# Altium project belt_control_V2.0.PrjPCB
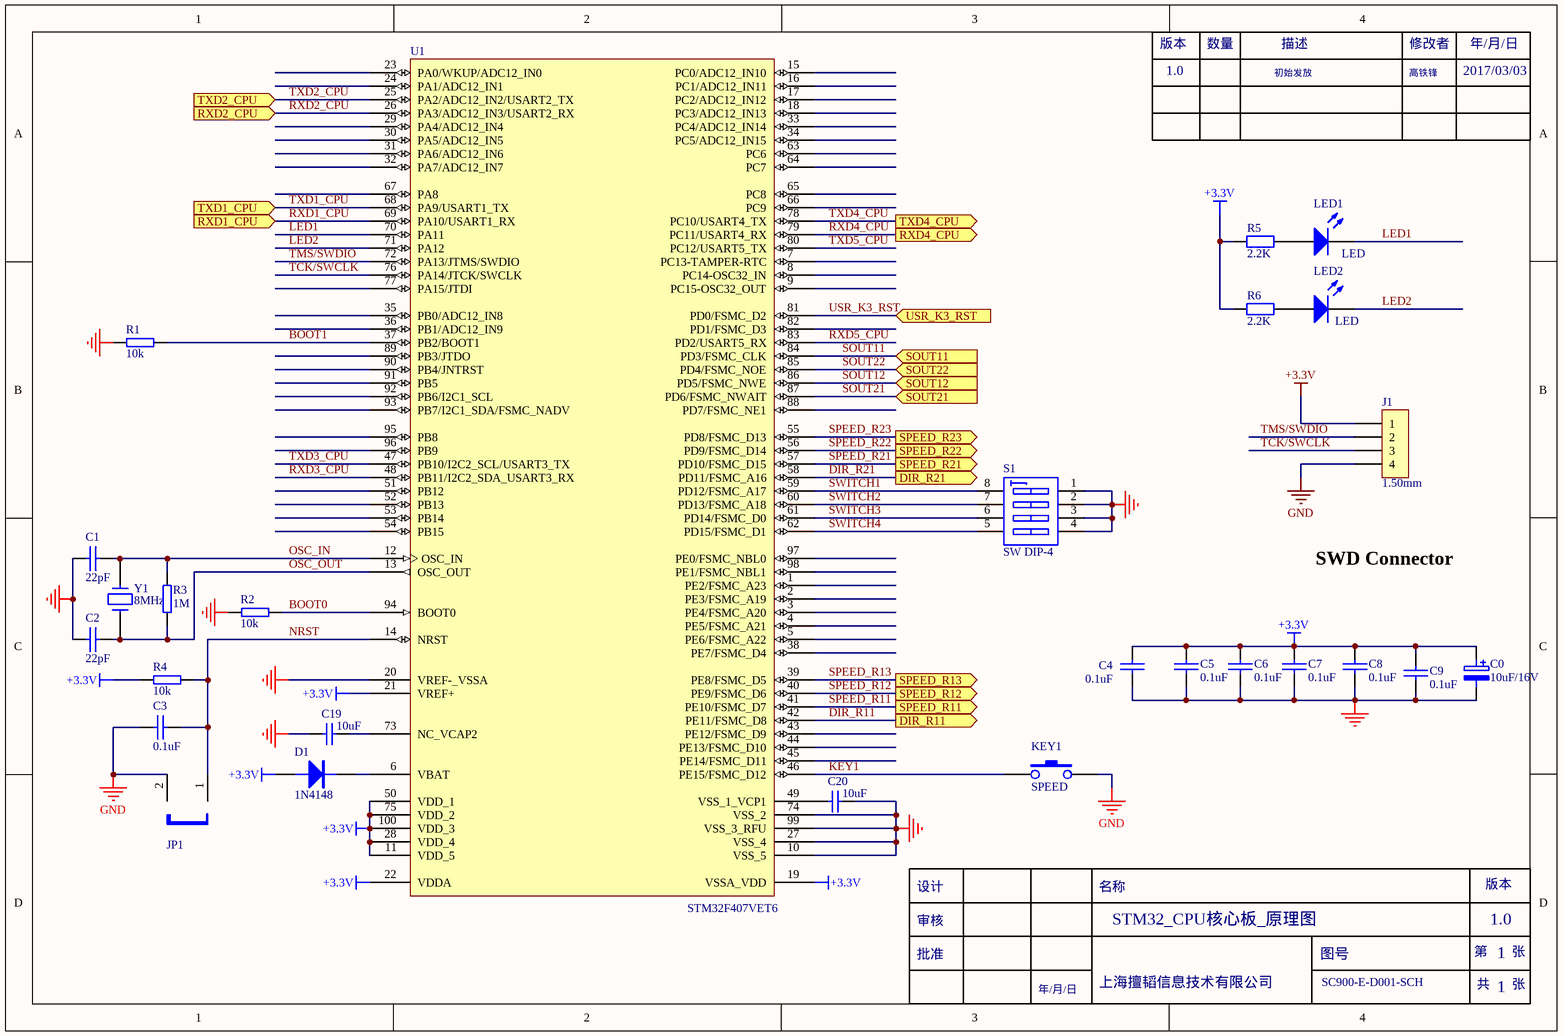
[diagram p0: cpu.SchDoc]
5 sheets, 118 parts. Net scope: flat (ports and power ports of the same name join across sheets).
Board file: belt_control_V2.0.PcbDoc
Sheets:
  cpu.SchDoc
  power.SchDoc
  belt_output.SchDoc
  senror_input.SchDoc
  communication.SchDoc

## Sheet cpu.SchDoc
size A4; Author: 上海擅韬信息技术有限公司

### Parts
C0  10uF/16V  [CASE-A_3216]
C1  22pF  [0805_CAP]
C2  22pF  [0805_CAP]
C3  0.1uF  [0805_CAP]
C4  0.1uF  [0805_CAP]
C5  0.1uF  [0805_CAP]
C6  0.1uF  [0805_CAP]
C7  0.1uF  [0805_CAP]
C8  0.1uF  [0805_CAP]
C9  0.1uF  [0805_CAP]
C19  10uF  [0805_CAP]
C20  10uF  [0805_CAP]
D1  1N4148  [LL-34(玻璃二极管)]
J1  1.50mm  [PH1.5_4P]
JP1  JUMPER  [SIP2]  (value not drawn)
KEY1  SPEED  [SW_PB_SMD_6X6]
LED1  LED  [0805-LED-R]
LED2  LED  [0805-LED-R]
R1  10k  [0805_RES]
R2  10k  [0805_RES]
R3  1M  [0805_RES]
R4  10k  [0805_RES]
R5  2.2K  [0805_RES]
R6  2.2K  [0805_RES]
S1  SW DIP-4  [SOP8_switch]
U1  STM32F407VET6  [LQFP100_14x14]
Y1  8MHz  [XTAL_US1]

### Ports
DIR_R11 (out), DIR_R21 (out), RXD1_CPU (in), RXD2_CPU (in), RXD4_CPU (out), SOUT11 (in), SOUT12 (in), SOUT21 (in), SOUT22 (in), SPEED_R11 (out), SPEED_R12 (out), SPEED_R13 (out), SPEED_R21 (out), SPEED_R22 (out), SPEED_R23 (out), TXD1_CPU (in), TXD2_CPU (in), TXD4_CPU (out), USR_K3_RST (in)

### Nets
+3.3V: C0.1 C4.1 C5.1 C6.1 C7.1 C8.1 C9.1 D1.1(A) J1.1 R4.1 R5.2 R6.2 U1.11(VDD_5) U1.19(VSSA_VDD) U1.21(VREF+) U1.22(VDDA) U1.28(VDD_4) U1.50(VDD_1) U1.75(VDD_2) U1.100(VDD_3)
GND: C0.2 C1.1 C2.1 C3.1 C4.2 C5.2 C6.2 C7.2 C8.2 C9.2 C19.2 C20.1 J1.4 JP1.2 KEY1.2 R1.1 R2.1 S1.1(A1) S1.2(A2) S1.3(A3) S1.4(A4) U1.10(VSS_5) U1.20(VREF-_VSSA) U1.27(VSS_4) U1.74(VSS_2) U1.99(VSS_3_RFU)
BOOT0: R2.2 U1.94(BOOT0)
BOOT1: R1.2 U1.37(PB2/BOOT1)
DIR_R11: U1.42(PE11/FSMC_D8) ; port DIR_R11
DIR_R21: U1.58(PD11/FSMC_A16) ; port DIR_R21
KEY1: KEY1.1 U1.46(PE15/FSMC_D12)
LED1: LED1.2(K) U1.70(PA11)
LED2: LED2.2(K) U1.71(PA12)
NRST: C3.2 JP1.1 R4.2 U1.14(NRST)
OSC_IN: C1.2 R3.2 U1.12(OSC_IN) Y1.2
OSC_OUT: C2.2 R3.1 U1.13(OSC_OUT) Y1.1
RXD1_CPU: U1.69(PA10/USART1_RX) ; port RXD1_CPU
RXD2_CPU: U1.26(PA3/ADC12_IN3/USART2_RX) ; port RXD2_CPU
RXD3_CPU: U1.48(PB11/I2C2_SDA_USART3_RX)
RXD4_CPU: U1.79(PC11/USART4_RX) ; port RXD4_CPU
RXD5_CPU: U1.83(PD2/USART5_RX)
SOUT11: U1.84(PD3/FSMC_CLK) ; port SOUT11
SOUT12: U1.86(PD5/FSMC_NWE) ; port SOUT12
SOUT21: U1.87(PD6/FSMC_NWAIT) ; port SOUT21
SOUT22: U1.85(PD4/FSMC_NOE) ; port SOUT22
SPEED_R11: U1.41(PE10/FSMC_D7) ; port SPEED_R11
SPEED_R12: U1.40(PE9/FSMC_D6) ; port SPEED_R12
SPEED_R13: U1.39(PE8/FSMC_D5) ; port SPEED_R13
SPEED_R21: U1.57(PD10/FSMC_D15) ; port SPEED_R21
SPEED_R22: U1.56(PD9/FSMC_D14) ; port SPEED_R22
SPEED_R23: U1.55(PD8/FSMC_D13) ; port SPEED_R23
SWITCH1: S1.8(B5) U1.59(PD12/FSMC_A17)
SWITCH2: S1.7(B6) U1.60(PD13/FSMC_A18)
SWITCH3: S1.6(A6) U1.61(PD14/FSMC_D0)
SWITCH4: S1.5(A5) U1.62(PD15/FSMC_D1)
TCK/SWCLK: J1.3 U1.76(PA14/JTCK/SWCLK)
TMS/SWDIO: J1.2 U1.72(PA13/JTMS/SWDIO)
TXD1_CPU: U1.68(PA9/USART1_TX) ; port TXD1_CPU
TXD2_CPU: U1.25(PA2/ADC12_IN2/USART2_TX) ; port TXD2_CPU
TXD3_CPU: U1.47(PB10/I2C2_SCL/USART3_TX)
TXD4_CPU: U1.78(PC10/USART4_TX) ; port TXD4_CPU
TXD5_CPU: U1.80(PC12/USART5_TX)
USR_K3_RST: U1.81(PD0/FSMC_D2) ; port USR_K3_RST
NetC19_1: C19.1 U1.73(NC_VCAP2)
NetC20_2: C20.2 U1.49(VSS_1_VCP1)
NetD1_2: D1.2(K) U1.6(VBAT)
NetLED1_1: LED1.1(A) R5.1
NetLED2_1: LED2.1(A) R6.1

Not connected (* = marked no-connect by the designer): U1 1(PE2/FSMC_A23) 2(PE3/FSMC_A19) 3(PE4/FSMC_A20) 4(PE5/FSMC_A21) 5(PE6/FSMC_A22) 7(PC13-TAMPER-RTC) 8(PC14-OSC32_IN) 9(PC15-OSC32_OUT) 15(PC0/ADC12_IN10) 16(PC1/ADC12_IN11) 17(PC2/ADC12_IN12) 18(PC3/ADC12_IN13) 23(PA0/WKUP/ADC12_IN0) 24(PA1/ADC12_IN1) 29(PA4/ADC12_IN4) 30(PA5/ADC12_IN5) 31(PA6/ADC12_IN6) 32(PA7/ADC12_IN7) 33(PC4/ADC12_IN14) 34(PC5/ADC12_IN15) 35(PB0/ADC12_IN8) 36(PB1/ADC12_IN9) 38(PE7/FSMC_D4) 43(PE12/FSMC_D9) 44(PE13/FSMC_D10) 45(PE14/FSMC_D11) 51(PB12) 52(PB13) 53(PB14) 54(PB15) 63(PC6) 64(PC7) 65(PC8) 66(PC9) 67(PA8) 77(PA15/JTDI) 82(PD1/FSMC_D3) 88(PD7/FSMC_NE1) 89(PB3/JTDO) 90(PB4/JNTRST) 91(PB5) 92(PB6/I2C1_SCL) 93(PB7/I2C1_SDA/FSMC_NADV) 95(PB8) 96(PB9) 97(PE0/FSMC_NBL0) 98(PE1/FSMC_NBL1)

### Notes on the sheet
- 1.0
- 初始发放
- 高铁锋
- 2017/03/03
- SWD Connector
- STM32_CPU核心板_原理图
- SC900-E-D001-SCH
- 1
- 版本
- 数量
- 描述
- 修改者
- 年/月/日
- 设计
- 审核
- 名称
- 批准
- 图号
- 第
- 共
- 张

### Library data of the parts
C0 = ELECTRO2: Electrolytic Capacitor
C1-C9 = CAP: Capacitor
C19 C20 = 0805 100nF(104) 10% 50V: 贴片电容; ComponentLink1Description: 供应商链接; ComponentLink1URL: http://www.szlcsc.com/product/details_50686.html; Package: 0805; Supplier: LC; SuppliersPartNumber: C49678
D1 = DIODE: LL-34(玻璃二极管)
J1 = CON4: Connector
JP1 = JUMPER: 2.54间距，2P，单排插针
KEY1 = SW-KEY-2
LED1 LED2 = LED2: Typical RED, GREEN, YELLOW, AMBER GaAs LED; Published: 8-Jun-2000; LatestRevisionDate: 17-Jul-2002; LatestRevisionNote: Re-released for DXP Platform.; PackageDocument: Feb-2002; PackageReference: 3.2X1.6X1.1; Publisher: Altium Limited
R1-R4 = RES
R5 R6 = Res2: Resistor; Published: 8-Jun-2000; LatestRevisionDate: 17-Jul-2002; LatestRevisionNote: Re-released for DXP Platform.; PackageReference: AXIAL-0.4; Publisher: Altium Limited; Value: 2.2K
S1 = SW DIP-4: DIP Switch
U1 = STM32F2xx_100: STM32 ARM-based 32-bit MCU with 64 Kbytes Flash, 100-pin LQFP, Industrial Temperature
Y1 = CRYSTAL

## Sheet power.SchDoc
size A3
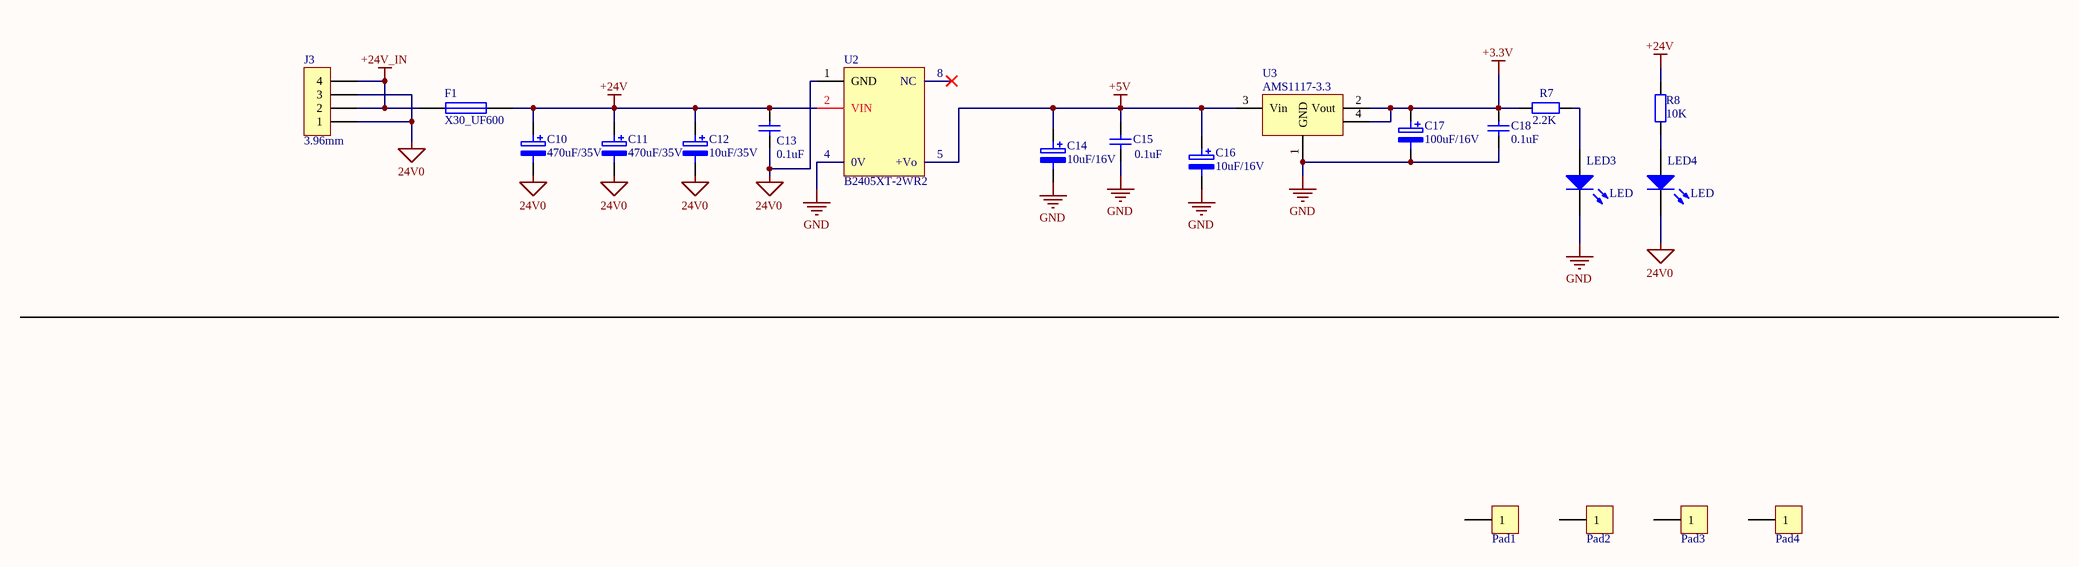
[diagram p1: power.SchDoc]

### Parts
C10  470uF/35V  [CE/10MM]
C11  470uF/35V  [CE/10MM]
C12  10uF/35V  [TC6032_C]
C13  0.1uF  [0805_CAP]
C14  10uF/16V  [CASE-A_3216]
C15  0.1uF  [0805_CAP]
C16  10uF/16V  [CASE-A_3216]
C17  100uF/16V  [TC6032_C]
C18  0.1uF  [0805_CAP]
F1  X30_UF600  [X30UF600]
J3  3.96mm  [VH3.96_4P]
LED3  LED  [0805-LED-G]
LED4  LED  [0805-LED-G]
Pad1  Pad  [pad35]  (value not drawn)
Pad2  Pad  [pad35]  (value not drawn)
Pad3  Pad  [pad35]  (value not drawn)
Pad4  Pad  [pad35]  (value not drawn)
R7  2.2K  [0805_RES]
R8  10K  [0805_RES]
U2  B2405XT-2WR2  [B2405XT-2WR2]
U3  AMS1117-3.3  [SOT223_3]

### Nets
24V0: C10.2 C11.2 C12.2 C13.1 J3.1 J3.3 LED4.2(K) U2.1(GND)
+3.3V: C17.1 C18.2 R7.2 U3.2(Vout) U3.4
+5V: C14.1 C15.2 C16.1 U2.5(+Vo) U3.3(Vin)
+24V: C10.1 C11.1 C12.1 C13.2 F1.2 R8.2 U2.2(VIN)
+24V_IN: F1.1 J3.2 J3.4
GND: C14.2 C15.1 C16.2 C17.2 C18.1 LED3.2(K) U2.4(0V) U3.1(GND)
NetLED3_1: LED3.1(A) R7.1
NetLED4_1: LED4.1(A) R8.1

Not connected (* = marked no-connect by the designer): Pad1 1; Pad2 1; Pad3 1; Pad4 1; U2 8(NC)*

### Notes on the sheet
- 电源电路

### Library data of the parts
C10-C12 C14 C16 C17 = ELECTRO2: Electrolytic Capacitor
C13 C15 C18 = Cap: Capacitor; Published: 8-Jun-2000; LatestRevisionDate: 17-Jul-2002; LatestRevisionNote: Re-released for DXP Platform.; PackageReference: RAD-0.3; Publisher: Altium Limited
  C13 C18: Value: 0.1uF
F1 = Fuse 1: Fuse; Published: 8-Jun-2000; LatestRevisionDate: 17-Jul-2002; LatestRevisionNote: Re-released for DXP Platform.; PackageReference: PIN-W2/E2.8; Publisher: Altium Limited
J3 = CON4: Connector
LED3 LED4 = LED2: as LED1 on sheet cpu; Published: 8-Jun-2000; LatestRevisionDate: 17-Jul-2002; LatestRevisionNote: Re-released for DXP Platform.; PackageDocument: Feb-2002; PackageReference: 3.2X1.6X1.1; Publisher: Altium Limited
R7 R8 = Res2: Resistor; Published: 8-Jun-2000; LatestRevisionDate: 17-Jul-2002; LatestRevisionNote: Re-released for DXP Platform.; PackageReference: AXIAL-0.4; Publisher: Altium Limited
  R7: Value: 2.2K
  R8: Value: 10K
U3 = AMS1117-5

## Sheet belt_output.SchDoc
size A3
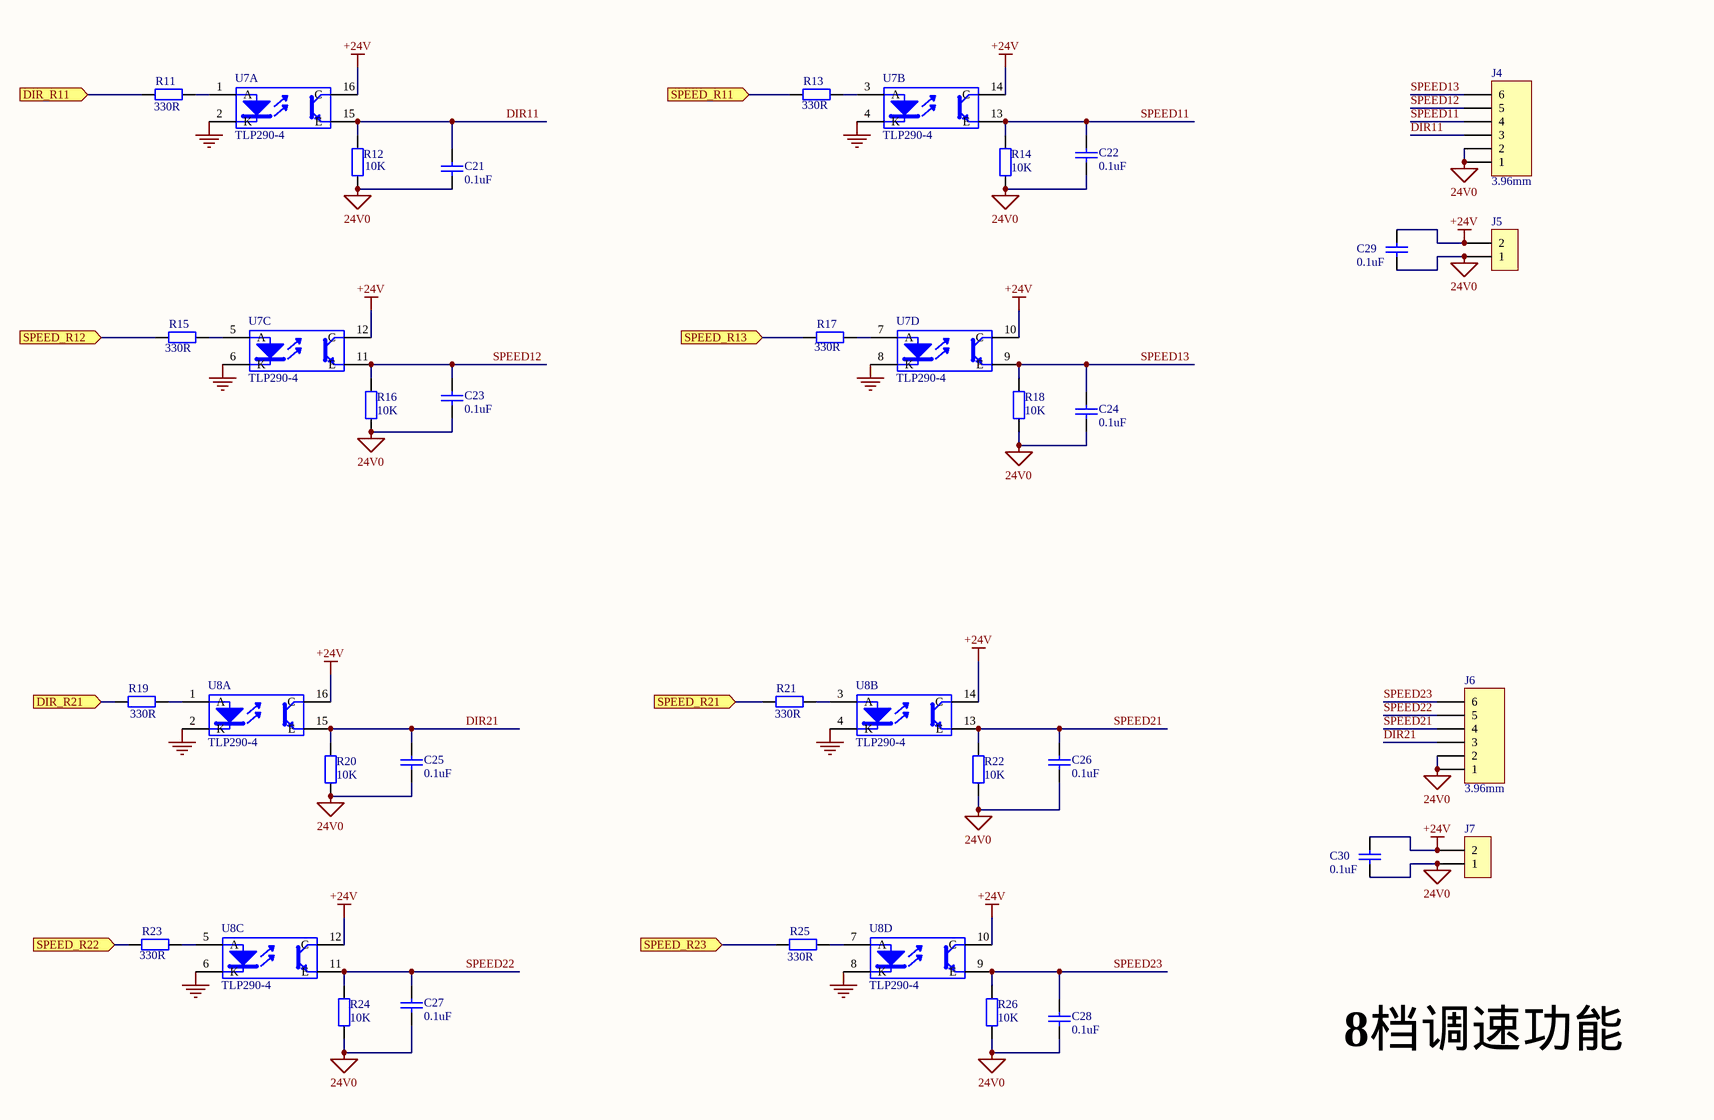
[diagram p2: belt_output.SchDoc]

### Parts
C21  0.1uF  [0805_CAP]
C22  0.1uF  [0805_CAP]
C23  0.1uF  [0805_CAP]
C24  0.1uF  [0805_CAP]
C25  0.1uF  [0805_CAP]
C26  0.1uF  [0805_CAP]
C27  0.1uF  [0805_CAP]
C28  0.1uF  [0805_CAP]
C29  0.1uF  [0805_CAP]
C30  0.1uF  [0805_CAP]
J4  3.96mm  [VH3.96_6P]
J5  HEADER1X2  [VH3.96_2P]  (value not drawn)
J6  3.96mm  [VH3.96_6P]
J7  HEADER1X2  [VH3.96_2P]  (value not drawn)
R11  330R  [0805_RES]
R12  10K  [0805_RES]
R13  330R  [0805_RES]
R14  10K  [0805_RES]
R15  330R  [0805_RES]
R16  10K  [0805_RES]
R17  330R  [0805_RES]
R18  10K  [0805_RES]
R19  330R  [0805_RES]
R20  10K  [0805_RES]
R21  330R  [0805_RES]
R22  10K  [0805_RES]
R23  330R  [0805_RES]
R24  10K  [0805_RES]
R25  330R  [0805_RES]
R26  10K  [0805_RES]
U7  TLP290-4  [SO16]  (parts A,B,C,D of 4)
U8  TLP290-4  [SO16]  (parts A,B,C,D of 4)

### Ports
DIR_R11 (in), DIR_R21 (in), SPEED_R11 (in), SPEED_R12 (in), SPEED_R13 (in), SPEED_R21 (in), SPEED_R22 (in), SPEED_R23 (in)

### Nets
24V0: C21.2 C22.2 C23.2 C24.2 C25.2 C26.2 C27.2 C28.2 C29.2 C30.2 J4.1 J4.2 J5.1 J6.1 J6.2 J7.1 R12.1 R14.1 R16.1 R18.1 R20.1 R22.1 R24.1 R26.1
+24V: C29.1 C30.1 J5.2 J7.2 U7.10(C) U7.12(C) U7.14(C) U7.16(C) U8.10(C) U8.12(C) U8.14(C) U8.16(C)
GND: U7.2(K) U7.4(K) U7.6(K) U7.8(K) U8.2(K) U8.4(K) U8.6(K) U8.8(K)
DIR11: C21.1 J4.3 R12.2 U7.15(E)
DIR21: C25.1 J6.3 R20.2 U8.15(E)
DIR_R11: R11.1 ; port DIR_R11
DIR_R21: R19.1 ; port DIR_R21
SPEED11: C22.1 J4.4 R14.2 U7.13(E)
SPEED12: C23.1 J4.5 R16.2 U7.11(E)
SPEED13: C24.1 J4.6 R18.2 U7.9(E)
SPEED21: C26.1 J6.4 R22.2 U8.13(E)
SPEED22: C27.1 J6.5 R24.2 U8.11(E)
SPEED23: C28.1 J6.6 R26.2 U8.9(E)
SPEED_R11: R13.1 ; port SPEED_R11
SPEED_R12: R15.1 ; port SPEED_R12
SPEED_R13: R17.1 ; port SPEED_R13
SPEED_R21: R21.1 ; port SPEED_R21
SPEED_R22: R23.1 ; port SPEED_R22
SPEED_R23: R25.1 ; port SPEED_R23
NetR11_2: R11.2 U7.1(A)
NetR13_2: R13.2 U7.3(A)
NetR15_2: R15.2 U7.5(A)
NetR17_2: R17.2 U7.7(A)
NetR19_2: R19.2 U8.1(A)
NetR21_2: R21.2 U8.3(A)
NetR23_2: R23.2 U8.5(A)
NetR25_2: R25.2 U8.7(A)

### Notes on the sheet
- 8档调速功能

### Library data of the parts
C21-C30 = Cap: Capacitor; Published: 8-Jun-2000; LatestRevisionDate: 17-Jul-2002; LatestRevisionNote: Re-released for DXP Platform.; PackageReference: RAD-0.3; Publisher: Altium Limited; Value: 0.1uF
J4 = Header 6H: Header, 6-Pin, Right Angle; LatestRevisionDate: 17-Jul-2002; LatestRevisionNote: Re-released for DXP Platform.; Publisher: Altium Limited
J6 = Header 6: Header, 6-Pin; LatestRevisionDate: 17-Jul-2002; LatestRevisionNote: Re-released for DXP Platform.; Publisher: Altium Limited
R11 R13 R15 R17 R19 R21 R23 R25 = Res2: Resistor; Value: 220; Published: 8-Jun-2000; LatestRevisionDate: 17-Jul-2002; LatestRevisionNote: Re-released for DXP Platform.; PackageReference: AXIAL-0.4; Publisher: Altium Limited
R12 R14 R16 R18 R20 R22 R24 R26 = Res2: Resistor; Published: 8-Jun-2000; LatestRevisionDate: 17-Jul-2002; LatestRevisionNote: Re-released for DXP Platform.; PackageReference: AXIAL-0.4; Publisher: Altium Limited; Value: 10K
U7 U8 = TLP521-4

## Sheet senror_input.SchDoc
size A3
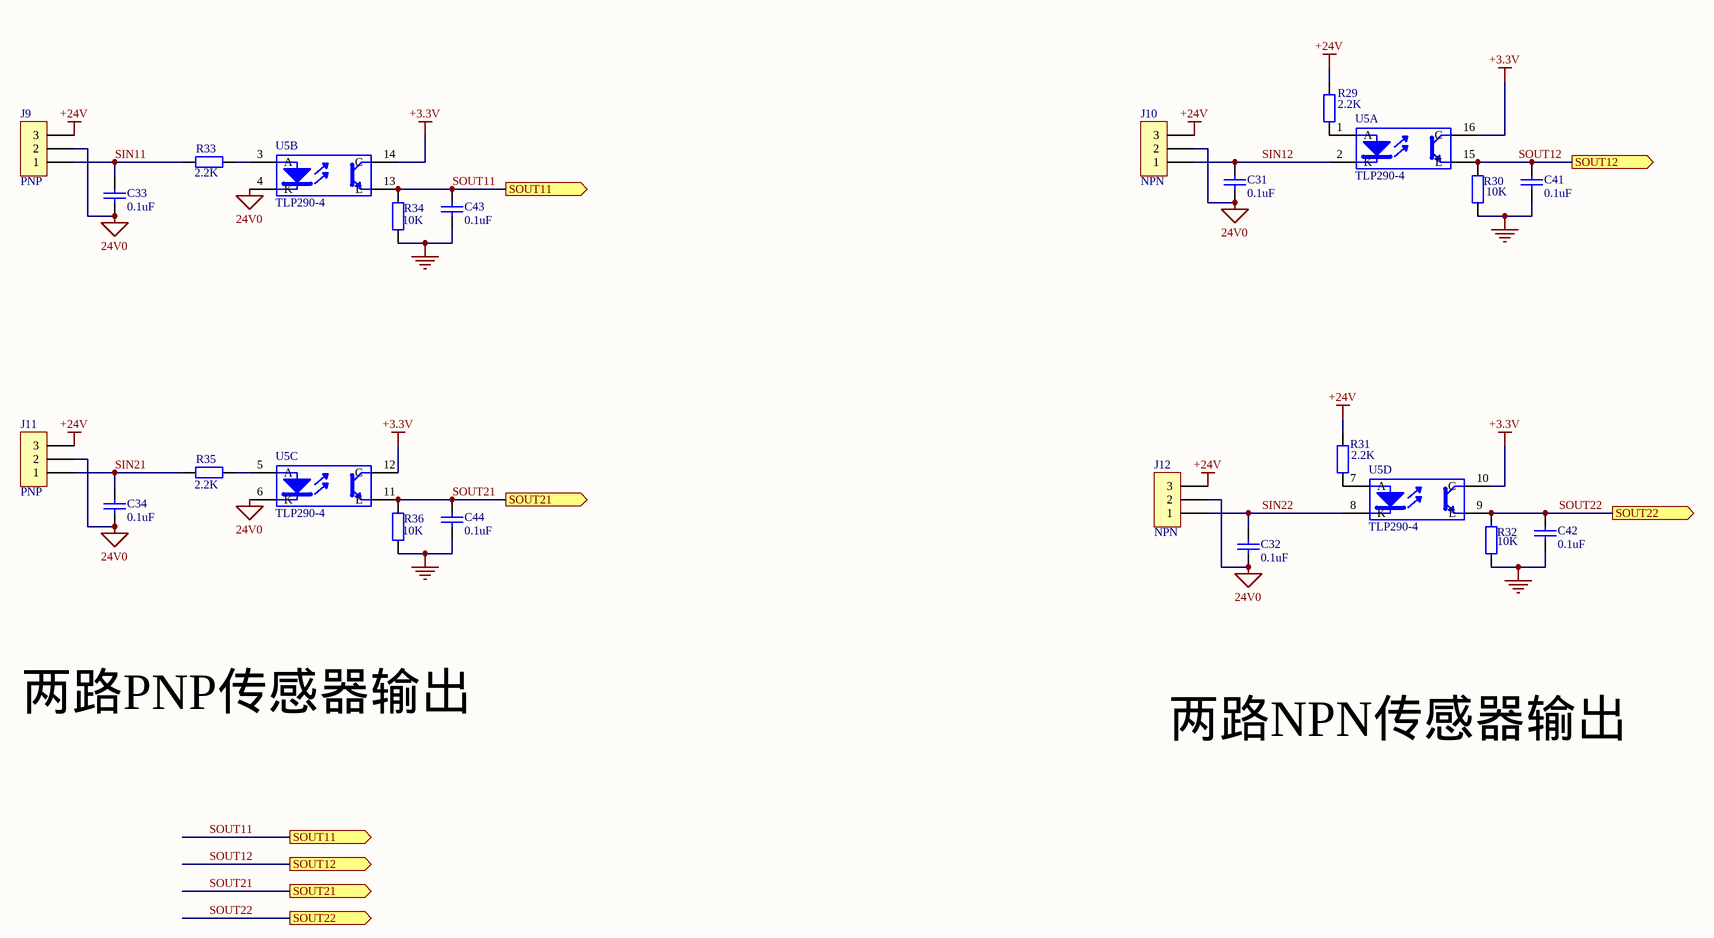
[diagram p3: senror_input.SchDoc]

### Parts
C31  0.1uF  [0805_CAP]
C32  0.1uF  [0805_CAP]
C33  0.1uF  [0805_CAP]
C34  0.1uF  [0805_CAP]
C41  0.1uF  [0805_CAP]
C42  0.1uF  [0805_CAP]
C43  0.1uF  [0805_CAP]
C44  0.1uF  [0805_CAP]
J9  HEADER1X3  [VH3.96_3P]  (value not drawn)
J10  HEADER1X3  [VH3.96_3P]  (value not drawn)
J11  HEADER1X3  [VH3.96_3P]  (value not drawn)
J12  HEADER1X3  [VH3.96_3P]  (value not drawn)
R29  2.2K  [0805_RES]
R30  10K  [0805_RES]
R31  2.2K  [0805_RES]
R32  10K  [0805_RES]
R33  2.2K  [0805_RES]
R34  10K  [0805_RES]
R35  2.2K  [0805_RES]
R36  10K  [0805_RES]
U5  TLP290-4  [SO16]  (parts A,B,C,D of 4)

### Ports
SOUT11 (out), SOUT12 (out), SOUT21 (out), SOUT22 (out)

### Nets
24V0: C31.2 C32.2 C33.2 C34.2 J9.2 J10.2 J11.2 J12.2 U5.4(K) U5.6(K)
+3.3V: U5.10(C) U5.12(C) U5.14(C) U5.16(C)
+24V: J9.3 J10.3 J11.3 J12.3 R29.1 R31.1
GND: C41.2 C42.2 C43.2 C44.2 R30.2 R32.2 R34.2 R36.2
SIN11: C33.1 J9.1 R33.1
SIN12: C31.1 J10.1 U5.2(K)
SIN21: C34.1 J11.1 R35.1
SIN22: C32.1 J12.1 U5.8(K)
SOUT11: C43.1 R34.1 U5.13(E) ; port SOUT11
SOUT12: C41.1 R30.1 U5.15(E) ; port SOUT12
SOUT21: C44.1 R36.1 U5.11(E) ; port SOUT21
SOUT22: C42.1 R32.1 U5.9(E) ; port SOUT22
NetR29_2: R29.2 U5.1(A)
NetR31_2: R31.2 U5.7(A)
NetR33_2: R33.2 U5.3(A)
NetR35_2: R35.2 U5.5(A)

### Notes on the sheet
- 两路PNP传感器输出
- 两路NPN传感器输出
- (in symbol HEADER1X3) PNP; NPN

### Library data of the parts
C31-C34 C41-C44 = Cap: Capacitor; Published: 8-Jun-2000; LatestRevisionDate: 17-Jul-2002; LatestRevisionNote: Re-released for DXP Platform.; PackageReference: RAD-0.3; Publisher: Altium Limited; Value: 0.1uF
R29 R31 R33-R36 = Res2: Resistor; Published: 8-Jun-2000; LatestRevisionDate: 17-Jul-2002; LatestRevisionNote: Re-released for DXP Platform.; PackageReference: AXIAL-0.4; Publisher: Altium Limited
  R29 R31 R33 R35: Value: 2.2K
  R34 R36: Value: 10K
R30 R32 = Res2: Resistor; Value: 1K; Published: 8-Jun-2000; LatestRevisionDate: 17-Jul-2002; LatestRevisionNote: Re-released for DXP Platform.; PackageReference: AXIAL-0.4; Publisher: Altium Limited
U5 = TLP521-4

## Sheet communication.SchDoc
size A4
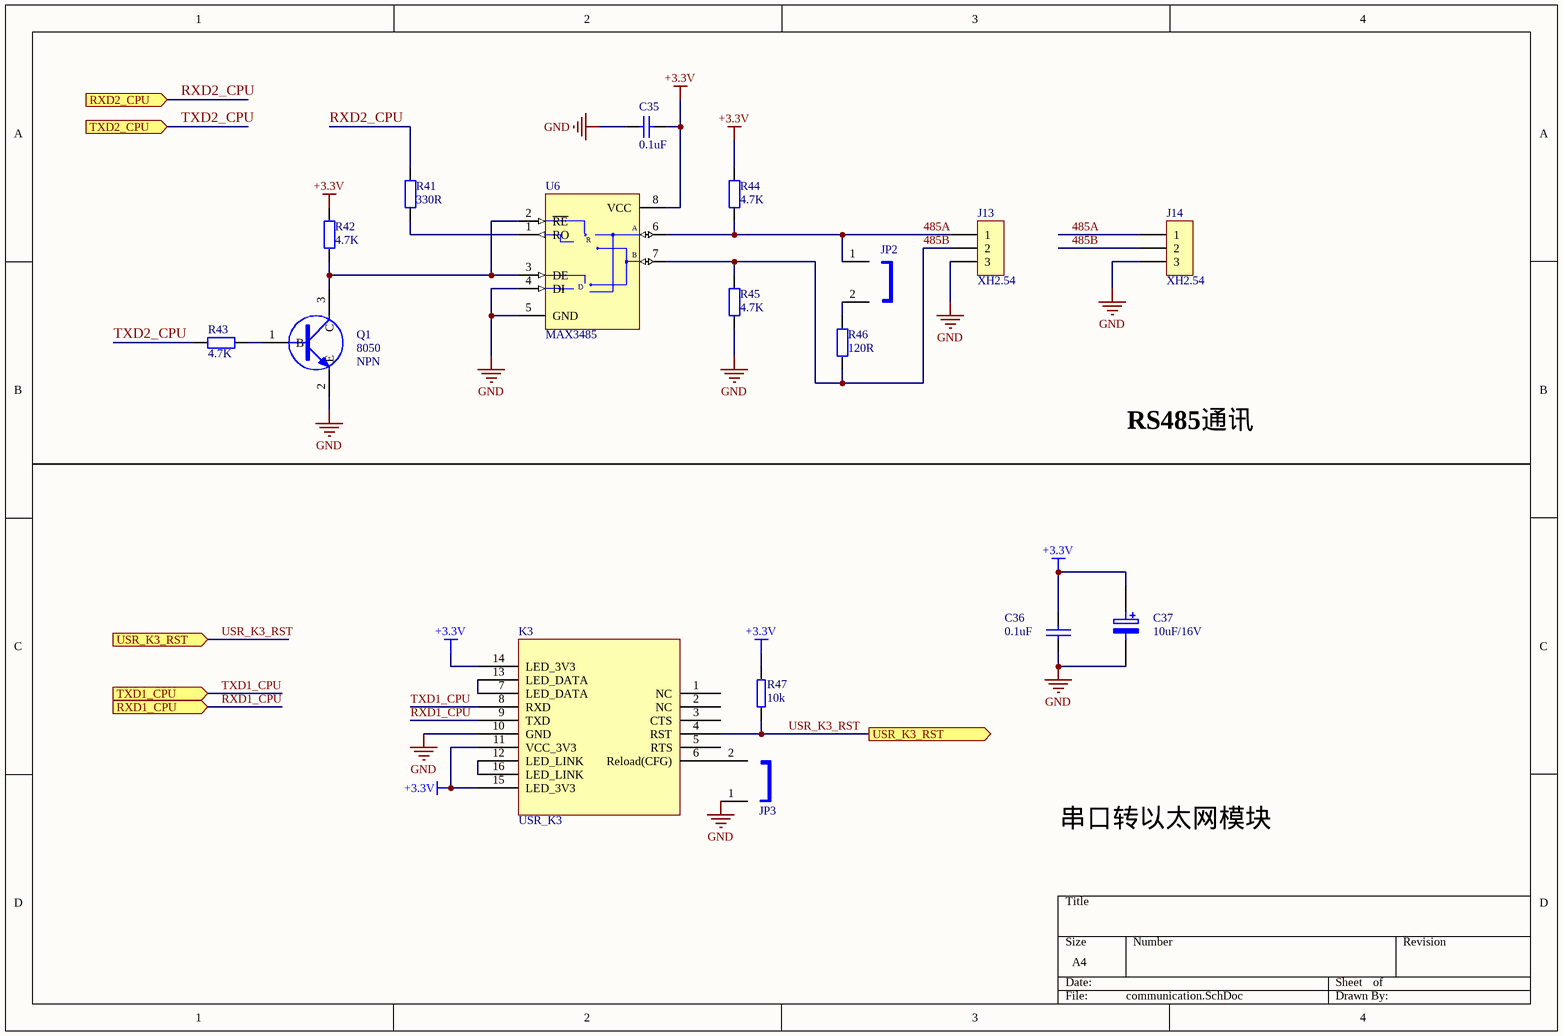
[diagram p4: communication.SchDoc]

### Parts
C35  0.1uF  [0805_CAP]
C36  0.1uF  [0805_CAP]
C37  10uF/16V  [CASE-A_3216]
J13  XH2.54  [XH2,.54-3P]
J14  XH2.54  [XH2,.54-3P]
JP2  JUMPER  [SIP2]  (value not drawn)
JP3  JUMPER  [SIP2]  (value not drawn)
K3  USR_K3  [USR-K3]
Q1  8050  [SOT-23]
R41  330R  [0805_RES]
R42  4.7K  [0805_RES]
R43  4.7K  [0805_RES]
R44  4.7K  [0805_RES]
R45  4.7K  [0805_RES]
R46  120R  [0805_RES]
R47  10k  [0805_RES]
U6  MAX3485  [SOIC-8_150mil]

### Ports
RXD1_CPU, RXD2_CPU (in), TXD1_CPU, TXD2_CPU (in), USR_K3_RST, USR_K3_RST (out)

### Nets
+3.3V: C35.2 C36.1 C37.1 K3.11(VCC_3V3) K3.14(LED_3V3) K3.15(LED_3V3) R42.2 R44.2 R47.2 U6.8(VCC)
GND: C35.1 C36.2 C37.2 J13.3 J14.3 JP3.1 K3.10(GND) Q1.2(E) R45.1 U6.4(DI) U6.5(GND)
485A: J13.1 J14.1 JP2.1 R44.1 U6.6(A)
485B: J13.2 J14.2 R45.2 R46.1 U6.7(B)
RXD1_CPU: K3.9(TXD) ; port RXD1_CPU
RXD2_CPU: R41.2 ; port RXD2_CPU
TXD1_CPU: K3.8(RXD) ; port TXD1_CPU
TXD2_CPU: R43.1 ; port TXD2_CPU
USR_K3_RST: K3.4(RST) R47.1 ; port USR_K3_RST
NetJP2_2: JP2.2 R46.2
NetJP3_2: JP3.2 K3.6(Reload(CFG))
NetK3_7: K3.7(LED_DATA) K3.13(LED_DATA)
NetK3_12: K3.12(LED_LINK) K3.16(LED_LINK)
NetQ1_1: Q1.1(B) R43.2
NetQ1_3: Q1.3(C) R42.1 U6.2(~{RE}) U6.3(DE)
NetR41_1: R41.1 U6.1(RO)

Not connected (* = marked no-connect by the designer): K3 1(NC) 2(NC) 3(CTS) 5(RTS)

### Notes on the sheet
- (near Q1) NPN
- RS485通讯
- 串口转以太网模块
- (in symbol MAX485) R; D

### Library data of the parts
C35 = Cap: Capacitor; Published: 8-Jun-2000; LatestRevisionDate: 17-Jul-2002; LatestRevisionNote: Re-released for DXP Platform.; PackageReference: RAD-0.3; Publisher: Altium Limited; Value: 0.1uF
C36 = CAP: Capacitor
C37 = ELECTRO2: Electrolytic Capacitor
J13 J14 = CON3: Connector
K3 = USR-K
Q1 = 3NPN_SO_1
R41-R45 = Res2: Resistor; Published: 8-Jun-2000; LatestRevisionDate: 17-Jul-2002; LatestRevisionNote: Re-released for DXP Platform.; PackageReference: AXIAL-0.4; Publisher: Altium Limited
  R41: Value: 330R
  R42-R45: Value: 4.7K
R46 = Res2: Resistor; Value: 120; Published: 8-Jun-2000; LatestRevisionDate: 17-Jul-2002; LatestRevisionNote: Re-released for DXP Platform.; PackageReference: AXIAL-0.4; Publisher: Altium Limited
R47 = RES
U6 = MAX485

## Nets that join several sheets
24V0: power (8 pins), belt_output (24 pins), senror_input (10 pins)
+3.3V: cpu (20 pins), power (5 pins), senror_input (U5.10 U5.12 U5.14 U5.16), communication (10 pins)
+24V: power (7 pins), belt_output (12 pins), senror_input (6 pins)
GND: cpu (26 pins), power (8 pins), belt_output (8 pins), senror_input (8 pins), communication (11 pins)
DIR_R11: cpu (U1.42), belt_output (R11.1)
DIR_R21: cpu (U1.58), belt_output (R19.1)
RXD1_CPU: cpu (U1.69), communication (K3.9)
RXD2_CPU: cpu (U1.26), communication (R41.2)
SOUT11: cpu (U1.84), senror_input (C43.1 R34.1 U5.13)
SOUT12: cpu (U1.86), senror_input (C41.1 R30.1 U5.15)
SOUT21: cpu (U1.87), senror_input (C44.1 R36.1 U5.11)
SOUT22: cpu (U1.85), senror_input (C42.1 R32.1 U5.9)
SPEED_R11: cpu (U1.41), belt_output (R13.1)
SPEED_R12: cpu (U1.40), belt_output (R15.1)
SPEED_R13: cpu (U1.39), belt_output (R17.1)
SPEED_R21: cpu (U1.57), belt_output (R21.1)
SPEED_R22: cpu (U1.56), belt_output (R23.1)
SPEED_R23: cpu (U1.55), belt_output (R25.1)
TXD1_CPU: cpu (U1.68), communication (K3.8)
TXD2_CPU: cpu (U1.25), communication (R43.1)
USR_K3_RST: cpu (U1.81), communication (K3.4 R47.1)